# Altium schematic sheet Sheet4.SchDoc: Наименование
size 839 x 594 mm; DocumentName2: принципиальная; DocumentName1: Схема электрическая; Lit1: o; CompanyName1: ООО; CompanyName2: "Нейрософт"; ENG_APP_DATE: --/--/--; DSN_APP_DATE: --/--/--; CHK_APP_DATE: --/--/--; Name1: Наименование1; lit_A: О; n_kontr: Н. Контр; t_kontr: Т. Контр; Name2: Наименование2; ApprovedBy: Утвердил; CheckedBy: Проверил; Author: Разработал; CompanyName: Организация; DrawnBy: Н.Контр; Engineer: Т.Контр; SheetNumber: 1; SheetTotal: 1; PageSetup: Record=PageOptions|CenterHorizontal=True|CenterVertical=True|PrintScale=0.94|XCorrection=1.00|YCorrection=1.00|PrintKind=1|BorderSize=5000000|LeftOffset=0|BottomOffset=0|Orientation=1|PaperLength=1000|PaperWidth=1000|Scale=100|PaperSource=7|PrintQuality=-4|MediaType=1|DitherType=10|PaperKind=A4|PrintScaleMode=1; DecimalNumber: Децимальный номер; HeadOfSector: Нач. сектора; MainDevice: Перв.примен.; Name: Наименование; DocumentName: Sheet1.SCHDOC
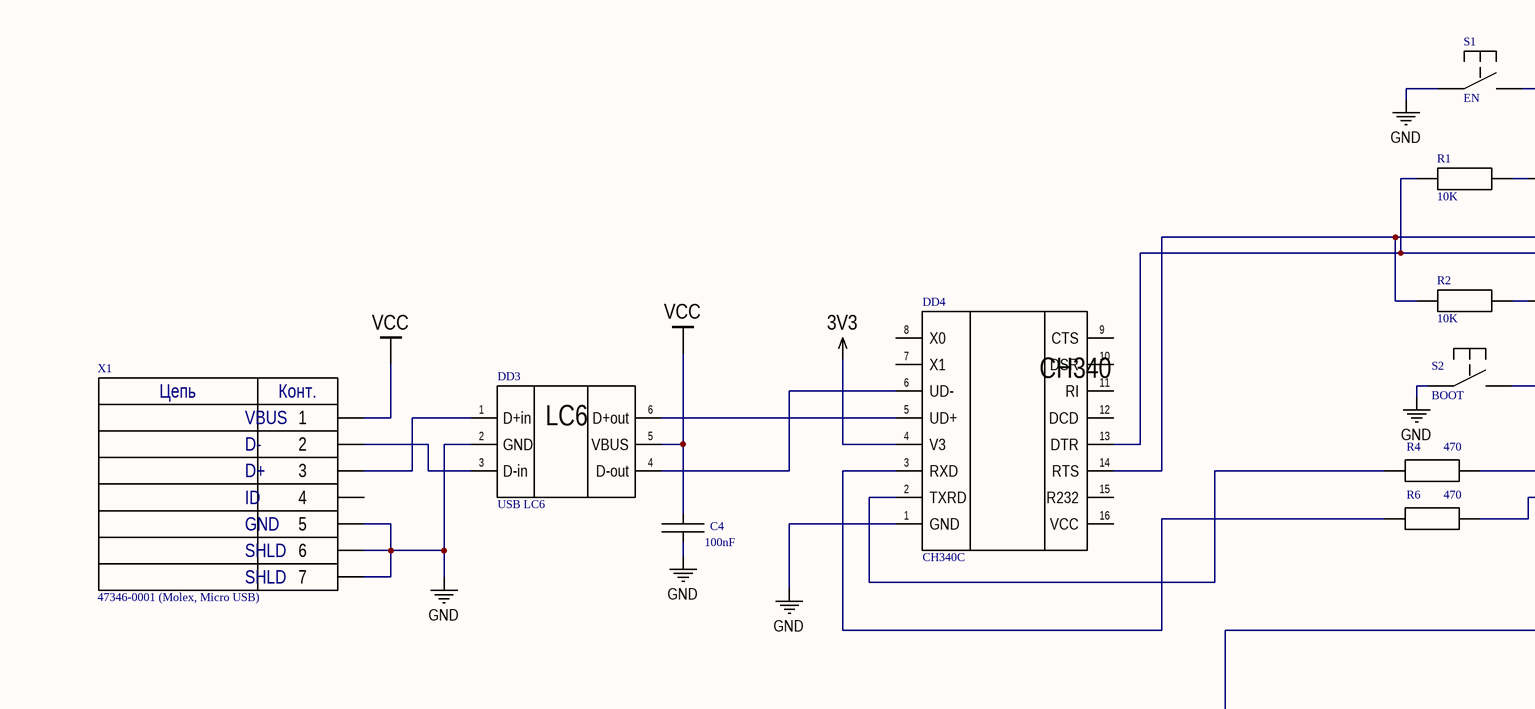
[diagram p0: Sheet4.SchDoc, top left]
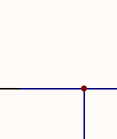
[diagram p1: Sheet4.SchDoc, top right]
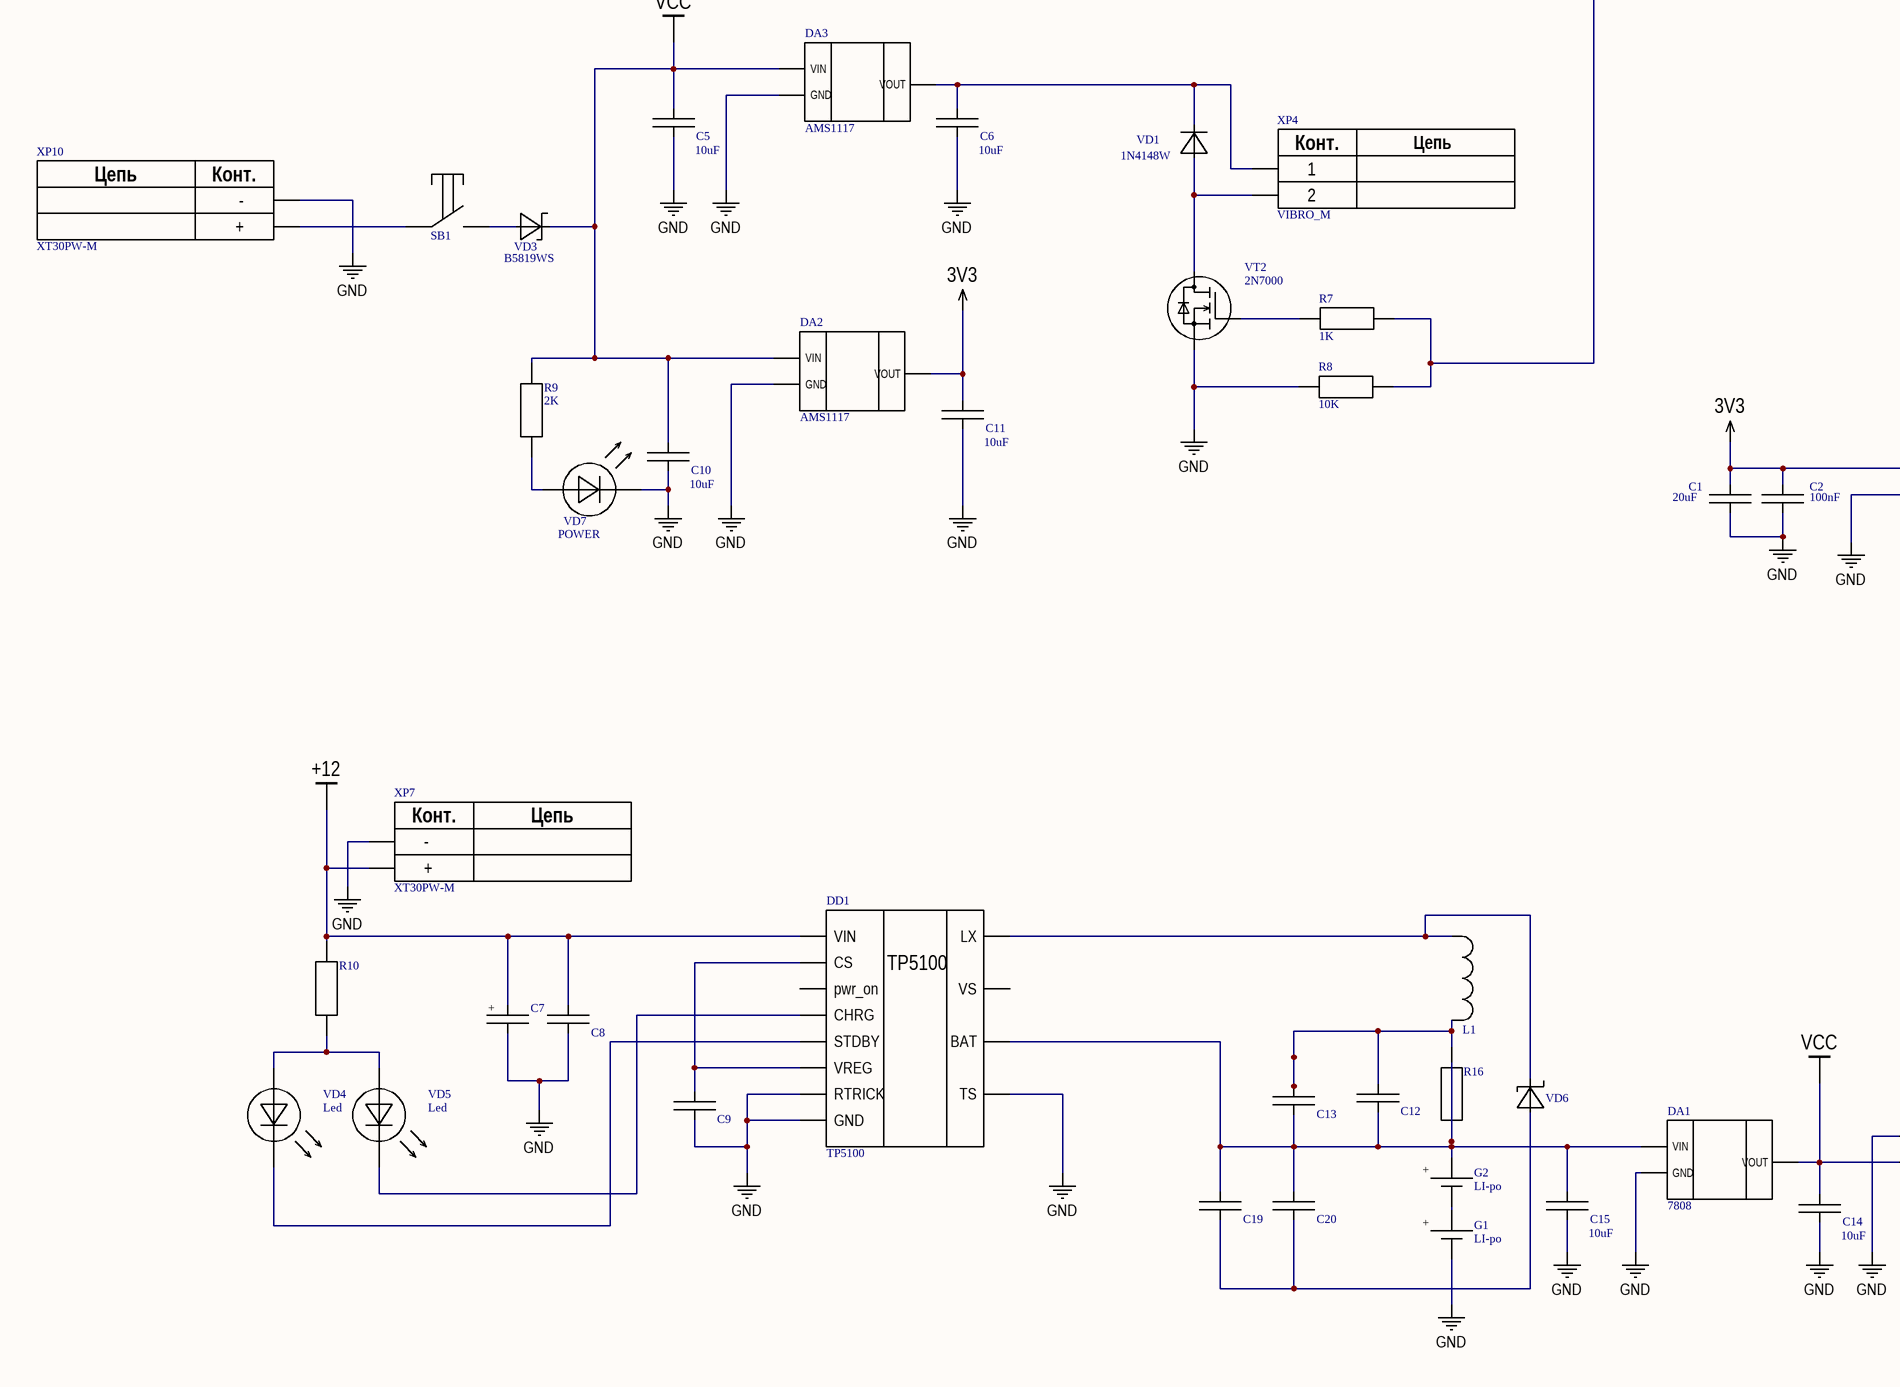
[diagram p2: Sheet4.SchDoc, bottom left]
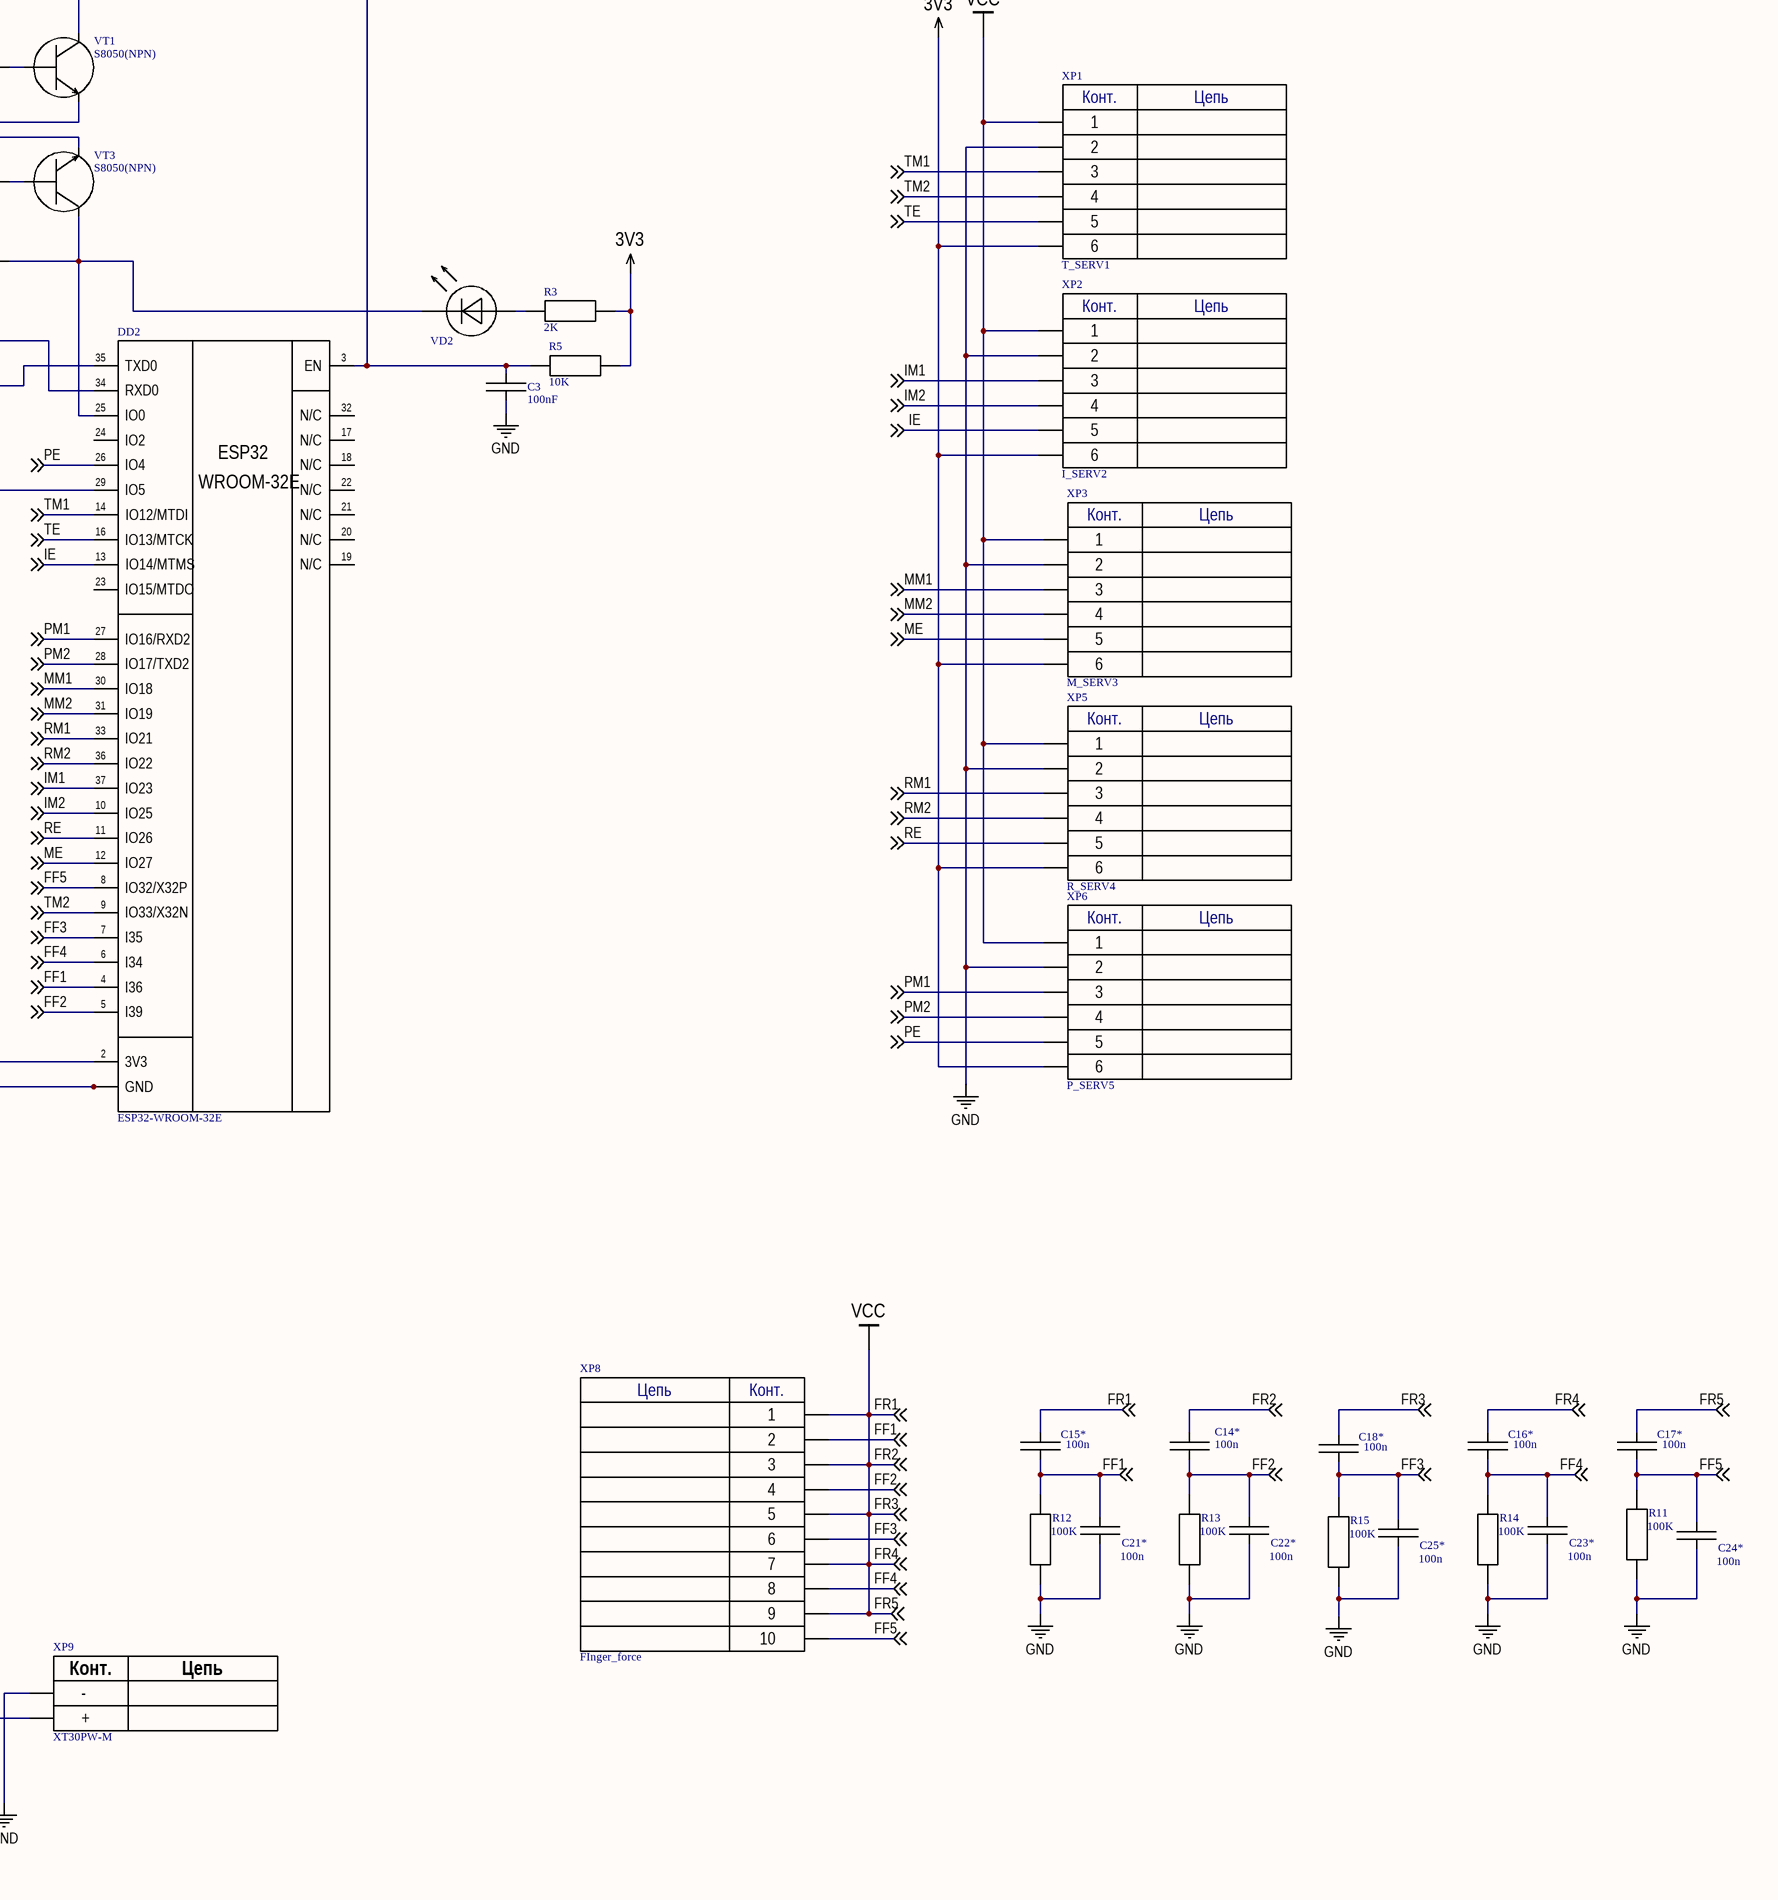
[diagram p3: Sheet4.SchDoc, bottom right]

## Parts
C1  20uF  [C0805]
C2  100nF  [C0805]
C3  100nF  [C0805]
C4  100nF  [C0805]
C5  10uF  [C0805]
C6  10uF  [C0805]
C7  Cap+  [C_EL_10]  (value not drawn)
C8  Cap  [CAP]  (value not drawn)
C9  Cap  [C0805]  (value not drawn)
C10  10uF  [C0805]
C11  10uF  [C0805]
C12  Cap  [C0805]  (value not drawn)
C13  Cap  [C0805]  (value not drawn)
C14  10uF  [C0805]
C14*  100n  [C0805]
C15  10uF  [C0805]
C15*  100n  [C0805]
C16*  100n  [C0805]
C17*  100n  [C0805]
C18*  100n  [C0805]
C19  Cap  [C0805]  (value not drawn)
C20  Cap  [C0805]  (value not drawn)
C21*  100n  [C0805]
C22*  100n  [C0805]
C23*  100n  [C0805]
C24*  100n  [C0805]
C25*  100n  [C0805]
DA1  7808  [StabV]
DA2  AMS1117  [SOT-223]
DA3  AMS1117  [SOT-223]
DD1  TP5100  [QFN-16]
DD2  ESP32-WROOM-32E  [ESP32-WROOM-32E]  (mechanical)
DD3  USB LC6  [SOT-23-6]
DD4  CH340C  [SO-16]
G1  LI-po
G2  LI-po
L1  INDUCROR  (value not drawn)
R1  10K  [R0603]
R2  10K  [R0603]
R3  2K  [R0805]
R4  470  [R0805]
R5  10K  [R0805]
R6  470  [R0805]
R7  1K  [R0805]
R8  10K  [R0805]
R9  2K  [R0805]
R10  res  [R0805]  (value not drawn)
R11  100K  [R0805]
R12  100K  [R0805]
R13  100K  [R0805]
R14  100K  [R0805]
R15  100K  [R0805]
R16  resistor  [R0805]  (value not drawn)
S1  EN  [SW4*3]
S2  BOOT  [SW4*3]
SB1  key power  (value not drawn)
VD1  1N4148W  [SOD-123]
VD2  /  [D0805]  (value not drawn)
VD3  B5819WS  [DIODE]
VD4  Led  [LED]
VD5  Led  [LED]
VD6  Schottky diode  [DO214]  (value not drawn)
VD7  POWER  [D0805]
VT1  S8050(NPN)  [SOT-23-3]
VT2  2N7000  [TO-92]
VT3  S8050(NPN)  [SOT-23-3]
X1  47346-0001 (Molex, Micro USB)  [47346-0001 (Molex, Micro USB)]
XP1  T_SERV1  [PLS-6]
XP2  I_SERV2  [PLS-6]
XP3  M_SERV3  [PLS-6]
XP4  VIBRO_M  [PLS-2]
XP5  R_SERV4  [PLS-6]
XP6  P_SERV5  [PLS-6]
XP7  XT30PW-M  [XT30PW-M]
XP8  FInger_force  [PLD-10]
XP9  XT30PW-M  [XT30PW-M]
XP10  XT30PW-M  [XT30PW-M]

## Nets
3V3: C1.1 C2.1 C11.2 DA2.2(VOUT) DD2.2(3V3) DD4.4(V3) R3.1 R5.1 XP1.6 XP2.6 XP3.6 XP5.6 XP6.6
+12: C7.1 C8.1 DD1.1(VIN) R10.2 XP7.2(+)
FF1: C4.1 C5.2 C10.2 C14.2 C14*.1 C14*.2 C15*.1 C15*.2 C16*.1 C16*.2 C17*.1 C17*.2 C18*.1 C18*.2 C21*.1 C22*.1 C23*.1 C24*.1 C25*.1 DA1.2(VOUT) DA2.3(VIN) DA3.3(VIN) DD2.4(I36) DD2.5(I39) DD2.6(I34) DD2.7(I35) DD2.8(IO32/X32P) DD2.9(IO33/X32N) DD2.10(IO25) DD2.11(IO26) DD2.12(IO27) DD2.13(IO14/MTMS) DD2.14(IO12/MTDI) DD2.16(IO13/MTCK) DD2.26(IO4) DD2.27(IO16/RXD2) DD2.28(IO17/TXD2) DD2.30(IO18) DD2.31(IO19) DD2.33(IO21) DD2.36(IO22) DD2.37(IO23) DD3.5(VBUS) R9.1 R11.2 R12.2 R13.2 R14.2 R15.2 VD3.2 X1.1 XP1.1 XP1.3 XP1.4 XP1.5 XP2.1 XP2.3 XP2.4 XP2.5 XP3.1 XP3.3 XP3.4 XP3.5 XP5.1 XP5.3 XP5.4 XP5.5 XP6.1 XP6.3 XP6.4 XP6.5 XP8.1 XP8.2 XP8.3 XP8.4 XP8.5 XP8.6 XP8.7 XP8.8 XP8.9 XP8.10 XP9.2(+) ; off-sheet   [also labelled FF2, FF3, FF4, FF5, FR1, FR2, FR3, FR4, FR5, IE, IM1, IM2, ME, MM1, MM2, PE, PM1, PM2, RE, RM1, RM2, TE, TM1, TM2, VCC]
GND: C1.2 C2.2 C3.2 C4.2 C5.1 C6.1 C7.2 C8.2 C9.2 C10.1 C11.1 C14.1 C15.1 C21*.2 C22*.2 C23*.2 C24*.2 C25*.2 DA1.1(GND) DA2.1(GND) DA3.1(GND) DD1.7(GND) DD1.11(TS) DD1.12(RTRICK) DD2.1(GND) DD2.15(GND) DD2.38(GND) DD2.39(GND) DD3.2(GND) DD4.1(GND) G1.2 R8.1 R11.1 R12.1 R13.1 R14.1 R15.1 S1.1 S2.1 VD7.2 VT2.1 X1.5 X1.6 X1.7 XP1.2 XP2.2 XP3.2 XP5.2 XP6.2 XP7.1(-) XP9.1(-) XP10.1(-)
NetC3_1: C3.1 DD2.3(EN) R5.2 S1.2 VT1.3
NetC6_2: C6.2 DA3.2(VOUT) VD1.2 XP4.1
NetC9_1: C9.1 DD1.10(VREG) DD1.13(CS)
NetC12_1: C12.1 C13.1 L1.1 R16.2
NetC12_2: C12.2 C13.2 C15.2 C19.1 C20.1 DA1.3(VIN) DD1.9(BAT) G2.1 R16.1
NetC19_2: C19.2 C20.2 VD6.1
NetDD1_2: DD1.2(LX) L1.2 VD6.2
NetDD1_14: DD1.14(STDBY) VD4.2
NetDD1_15: DD1.15(CHRG) VD5.2
NetDD2_25: DD2.25(IO0) S2.2 VD2.2 VT3.3
NetDD2_29: DD2.29(IO5) R7.2 R8.2
NetDD2_34: DD2.34(RXD0) R4.2
NetDD2_35: DD2.35(TXD0) R6.2
NetDD3_1: DD3.1(D+in) X1.3
NetDD3_3: DD3.3(D-in) X1.2
NetDD3_4: DD3.4(D-out) DD4.6(UD-)
NetDD3_6: DD3.6(D+out) DD4.5(UD+)
NetDD4_2: DD4.2(TXRD) R4.1
NetDD4_3: DD4.3(RXD) R6.1
NetDD4_13: DD4.13(DTR) R1.2 VT3.2
NetDD4_14: DD4.14(RTS) R2.2 VT1.2
NetG1_1: G1.1 G2.2
NetR1_1: R1.1 VT1.1
NetR2_1: R2.1 VT3.1
NetR3_2: R3.2 VD2.1
NetR7_1: R7.1 VT2.2
NetR9_2: R9.2 VD7.1
NetR10_1: R10.1 VD4.1 VD5.1
NetSB1_1: SB1.1 XP10.2(+)
NetSB1_2: SB1.2 VD3.1
NetVD1_1: VD1.1 VT2.3 XP4.2

Not connected (* = marked no-connect by the designer): DD1 6(pwr_on) 8(VS); DD2 17(N/C) 18(N/C) 19(N/C) 20(N/C) 21(N/C) 22(N/C) 23(IO15/MTDO) 24(IO2) 32(N/C); DD4 7(X1) 8(X0) 9(CTS) 10(DSR) 11(RI) 12(DCD) 15(R232) 16(VCC); X1 4

## Notes on the sheet
- Перв.примен.
- Справ.№
- Подп. и дата
- Инв.№ дубл.
- Взам.инв.№
- Подп.и дата
- Разраб.
- Изм.
- Лист
- № докум.
- Подп.
- Дата
- Лит.
- Масштаб
- Масса
- Т.контр.
- Пров.
- СХЕМА   ЭЛЕКТРИЧЕСКАЯ
- ПРИНЦИПИАЛЬНАЯ
- Листов
- Инв.№ подл.
- Утв.
- Н.контр.
- Нач.сект.
- Формат  A1
- (in symbol 47346-0001 (Molex, Micro USB)) Цепь; Конт.; VBUS; D-; D+; ID; GND; SHLD
- (in symbol Cap+) +
- (in symbol CH340C) CH340
- (in symbol ESP32-WROOM-32E) ESP32; WROOM-32E
- (in symbol LI-po) +
- (in symbol PLD-10) Цепь; Конт.
- (in symbol PLS-2) Конт.; Цепь
- (in symbol PLS-6) Конт.; Цепь
- (in symbol USB LC6) LC6
- (in symbol XT30PW-M) Конт.; Цепь

## Library data of the parts
C1-C6 C10 C11 C14 C14* C15 C15* C16* C17* C18* C21* C22* C23* C24* C25* = Cap
DD2 = ESP32-WROOM-32E: PCB Antenna - 4,8,16 MB Flash - WiFi - BT - MCU; Manufacturer_Name: Espressif Systems; ComponentLink1Description: Datasheet; ComponentLink1URL: https://www.espressif.com/sites/default/files/documentation/esp32-wroom-32e_esp32-wroom-32ue_datasheet_en.pdf; ComponentLink2Description: SoC Datasheet; ComponentLink2URL: https://www.espressif.com/sites/default/files/documentation/esp32_datasheet_en.pdf; ComponentLink3Description: Devkit; ComponentLink3URL: https://www.espressif.com/en/products/devkits/esp32-devkitc
R1-R9 R11-R15 = res
S1 S2 = Key
VD1 = VD
VD2 VD7 = Led
VD3 = Schottky diode
VT1 VT3 = npn
VT2 = MOSFET (N-Channel)
XP1-XP3 XP5 XP6 = PLS-6
XP4 = PLS-2
XP8 = PLD-10